# Altium schematic sheet BoardA-Power.SchDoc
size A; SheetNumber: 2; SheetTotal: 2; SPICEModelCachePPHTLYSU: <root> / <DocumentId>PPHTLYSU</DocumentId> / <CacheFrame Number="0"> / <Model Name="umk107bj105_a-t" Kind="CKT"> / <Text>* UMK107BJ105_A-T     SPICE MODEL  ( General Type ) / *-------------------------------------------------------------------------------------------------------- / * Model Generated by TAIYO YUDEN Corporation (http://www.ty-top.com) / * Version 1.0 / * TAIYO YUDEN Control No. 170508_130520 / * Copyright(c) 2012 TAIYO YUDEN CO.,LTD. All Rights Reserved. / *-------------------------------------------------------------------------------------------------------- / * / * Products Name : Multilayer Ceramic Capacitors / * / * Characteristics : / *     Capacitance : 1 uF , Rated Voltage : 50V , TCC : X5R / *     Case Size : 1.6 x 0.8 / 0.063 x 0.031 [mm/inch] , Thickness : 0.8 / 0.031 [mm/inch] / *     (Conditions: Temperature = 25 degC , DC Bias Current/Voltage = 0A / 0V) / * / * Frequency Range : 40Hz - 3GHz / * / * External Node Assignments : / * / *  1  o---| |---o  2 / * / *-------------------------------------------------------------------------------------------------------- / .SubCkt UMK107BJ105_A-T 1 2 / **************************** / C0 1 110 0.79929u / Cm 1 101 0.13681u / C1 101 102 0.26224u / Rc1 101 102 5.8806k / C2 102 103 0.057839u / Rc2 102 103 469.42 / C3 103 110 0.014568u / Rc3 103 110 14.853 / C2m 1 301 0.13283u / C21 301 302 1.2593u / Rc21 301 302 6.3079k / C22 302 303 1.1189u / Rc22 302 303 6.9405k / C23 303 304 1.1421u / Rc23 303 304 6.4848k / C24 304 305 0.36861u / Rc24 304 305 785 / C25 305 306 0.39327u / Rc25 305 306 637.41 / C26 306 307 0.27451u / Rc26 306 307 19.365 / C27 307 308 0.15295u / Rc27 307 308 23.239 / C28 308 309 0.17569u / Rc28 308 309 17.788 / C29 309 110 1420.6p / Rc29 309 110 1.9725 / Rp0 1 110 500Meg / L0 110 120 0.24088n / Lm 120 130 0.1369n / L1 120 121 0.1842n / RL1 121 130 0.29804 / L2 120 122 0.40657n / RL2 122 130 0.57395 / L3 120 123 0.85773n / RL3 123 130 0.82282 / CR 120 124 0.11463u / LR 124 125 0.25983n / RR 125 130 52.447m / CL 130 140 1.4637p / LL 130 140 0.23986n / RL 130 140 33.985 / Rs 140 2 6.8539m / **************************** / .ends UMK107BJ105_A-T</Text> / </Model> / </CacheFrame> / </root>
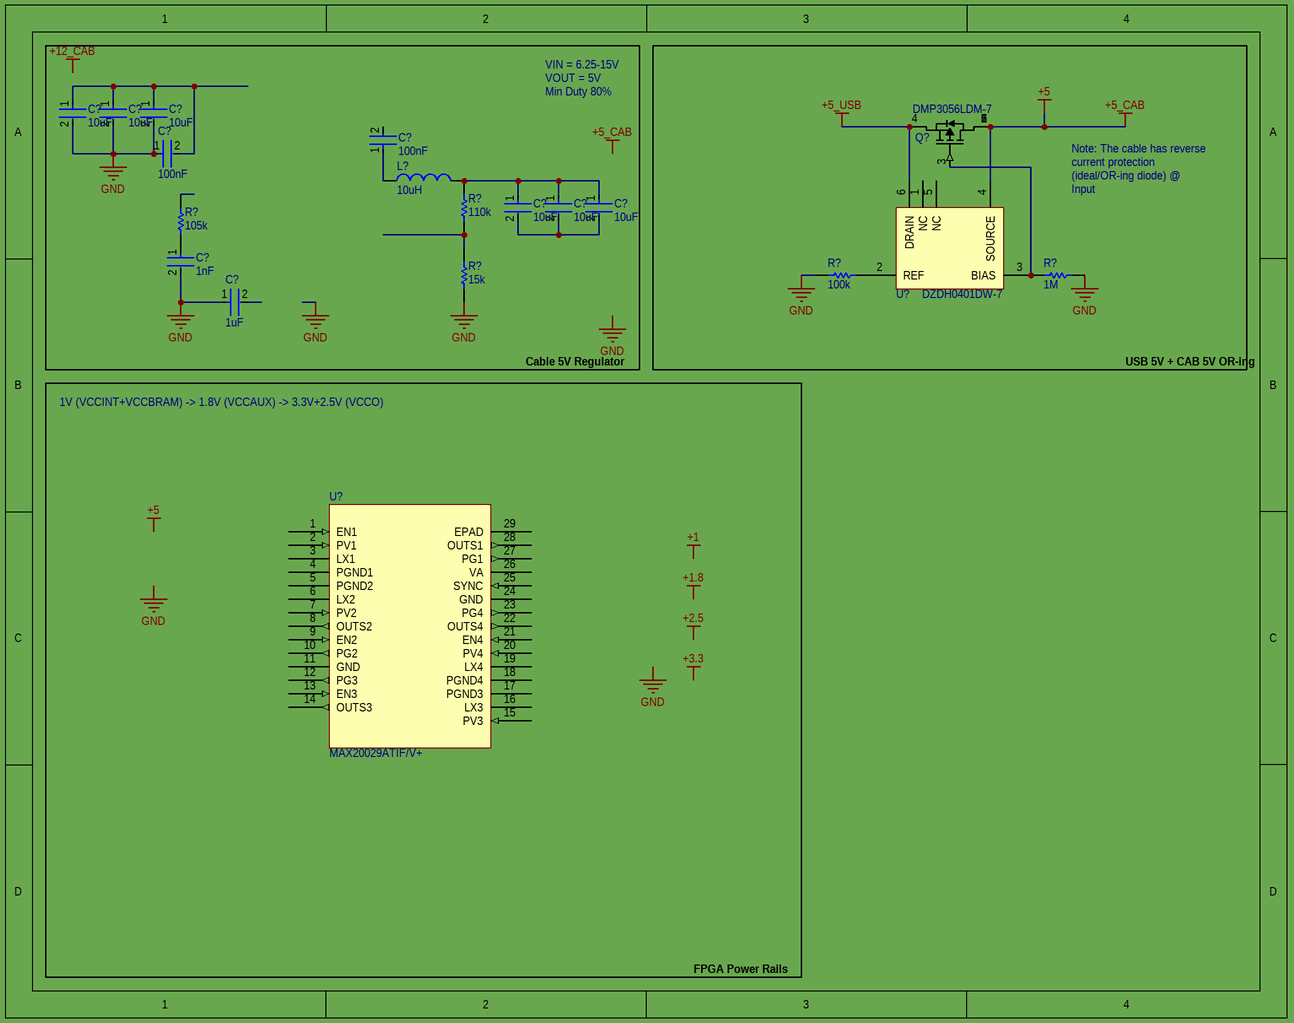
[diagram p0: BoardA-Power.SchDoc]

## Parts
(Parts that share a designator on the sheet are numbered #1, #2 ... from top to bottom, then left to right.)
C?#1  10uF  [FP-GRM188-0_2-MFG]
C?#2  10uF  [FP-GRM188-0_2-MFG]
C?#3  10uF  [FP-GRM188-0_2-MFG]
C?#4  100nF  [FP-CGA3E-0_3-0_1-IPC_C]
C?#5  100nF  [FP-CGA3E-0_3-0_1-IPC_C]
C?#6  10uF  [FP-GRM188-0_2-MFG]
C?#7  10uF  [FP-GRM188-0_2-MFG]
C?#8  10uF  [FP-GRM188-0_2-MFG]
C?#9  1nF  [FP-0603-L_1_6_0_15-W_0_81-IPC_A]
C?#10  1uF  [FP-0603-L_1_6_0_1-W_0_8_0-IPC_A]
L?  10uH  [VISH-IHLP2525C-01_V]
Q?  DMP3056LDM-7  [SOT95P285X130-6N]
R?#1  110k  [RESC1608X55X30ML20T20]
R?#2  105k  [RESC1608X55X30NL15T15]
R?#3  1M  [RESC1608X55X30LL15T15]
R?#4  15k  [RESC1608X55X30NL15T15]
R?#5  100k  [RESC1608X55X30ML20T20]
U?#1  DZDH0401DW-7  [DZDH0401DW-7]
U?#2  MAX20029ATIF/V+  [MAX20029ATIF/V+]

## Blocks framed on the sheet
USB 5V + CAB 5V OR-ing: Q? R?#3 R?#5 U?#1

## Nets
+5: Q?.1 Q?.2 Q?.5 Q?.6 U?#1.4(SOURCE)  [also labelled +5_CAB]
+5_USB: Q?.4 U?#1.6(DRAIN)
GND: C?#1.2 C?#2.2 C?#3.2 C?#4.1 C?#9.2 C?#10.1 R?#3.2 R?#4.1 R?#5.2
NetC?#1_1: C?#1.1 C?#2.1 C?#3.1 C?#4.2
NetC?#5_1: C?#5.1 L?.1
NetC?#6_1: C?#6.1 C?#7.1 C?#8.1 L?.2 R?#1.2
NetC?#6_2: C?#6.2 C?#7.2 C?#8.2
NetC?#9_1: C?#9.1 R?#2.1
NetQ?_3: Q?.3 R?#3.1 U?#1.3(BIAS)
NetR?#1_1: R?#1.1 R?#4.2
NetR?#5_1: R?#5.1 U?#1.2(REF)

Not connected (* = marked no-connect by the designer): C?#5 2; C?#10 2; R?#2 2; U?#1 1(NC) 5(NC); U?#2 1(EN1) 2(PV1) 3(LX1) 4(PGND1) 5(PGND2) 6(LX2) 7(PV2) 8(OUTS2) 9(EN2) 10(PG2) 11(GND) 12(PG3) 13(EN3) 14(OUTS3) 15(PV3) 16(LX3) 17(PGND3) 18(PGND4) 19(LX4) 20(PV4) 21(EN4) 22(OUTS4) 23(PG4) 24(GND) 25(SYNC) 26(VA) 27(PG1) 28(OUTS1) 29(EPAD)

## Notes on the sheet
- VIN = 6.25-15V
- VOUT = 5V
- Min Duty 80%
- Note: The cable has reverse current protection (ideal/OR-ing diode) @ Input
- Cable 5V Regulator
- 1V (VCCINT+VCCBRAM) -> 1.8V (VCCAUX) -> 3.3V+2.5V (VCCO)
- FPGA Power Rails
- Labels drawn without touching a wire or pin: +1, +1.8, +2.5, +3.3, +5, +5_CAB, +12_CAB, GND

## Library data of the parts
C?#1-C?#3 C?#6-C?#8 = CMP-2006-02520-2: Chip Multilayer Ceramic Capacitors for General Purpose, 0603, 10uF, X5R, 15%, 20%, 25V; Tolerance: 20%; Resistor Type: Ceramic; Voltage: 25V; Max Operating Temperature: 85°C; Min Operating Temperature: -55°C; Capacitance: 10uF; Dielectric: X5R; Lead Free: Lead Free; REACH SVHC: No SVHC; Case/Package: 0603; Mount: Surface Mount; Voltage Rating (DC): 25V; Height: 0.8mm; Length: 1.6mm; Thickness: 0.031inch; Width: 0.031inch; Termination: SMD/SMT; Case Code (Imperial): 0603; Case Code (Metric): 1608; Package Quantity: 1; Packaging: Tape and Reel; Depth: 0.8mm; Voltage Rating: 25V; Weight: 0.000222oz; Number of Pins: 2
C?#4 C?#5 = CMP-2000-07546-2: Cap Ceramic 100nF 50V X7R 10% Pad SMD 0603 +125°C Automotive T/R; Weight: 7.1E-05oz; Composition: Ceramic; Max Operating Temperature: 125°C; Termination: SMD/SMT; Dielectric: X7R; Length: 1.6mm; Package Quantity: 1; REACH SVHC: No SVHC; Lead Free: Lead Free; Case Code (Metric): 1608; Min Operating Temperature: -55°C; Packaging: Tape and Reel; Tolerance: 10%; Voltage Rating: 50V; Case Code (Imperial): 0603; Capacitance: 100nF; Case/Package: 0603; Voltage Rating (DC): 50V; Depth: 0.8mm; Radiation Hardening: No; Ratings: AEC-Q200; Mount: Surface Mount; Voltage: 50V; Thickness: 0.035inch; Width: 0.8mm; Height: 0.8mm
C?#9 = CMP-2006-04378-2: General Purpose Ceramic Capacitor, 0603, 1nF, 10%, X7R, 15%, 50V; Case Code (Metric): 1608; Min Operating Temperature: -55°C; Weight: 7.1E-05oz; Series: -; Capacitance: 1nF; RoHS Compliant: Yes; Radiation Hardening: No; Height: 0.9mm; Mount: Surface Mount; REACH SVHC: No SVHC; Lead Free: Lead Free; Depth: 0.81mm; Voltage: 50V; Number of Pins: 2; Voltage Rating: 50V; Max Operating Temperature: 125°C; Termination: SMD/SMT; Construction: Flat; Case Code (Imperial): 0603; Dielectric: X7R; Width: 0.032inch; Tolerance: 10%; Case/Package: 0603; Contact Plating: Tin; Packaging: Tape and Reel; Voltage Rating (DC): 50V; Dielectric Material: Ceramic; Package Quantity: 4000; Thickness: 0.035inch; Length: 1.6mm
C?#10 = CMP-2000-05447-3: None; Tolerance: 10%; Voltage Rating: 50V; Dielectric: X5R; Height: 0.8mm; Depth: 0.8mm; Number of Pins: 2; Length: 1.6mm; Thickness: 0.035inch; Contact Plating: Nickel; Radiation Hardening: No; Package Quantity: 1; Case/Package: 0603; Capacitance: 1uF; Halogen Free: Halogen Free; RoHS Compliant: Yes; Termination: SMD/SMT; Max Operating Temperature: 85°C; Min Operating Temperature: -55°C; Case Code (Metric): 1608; Construction: Flat; Voltage Rating (DC): 50V; Packaging: Tape and Reel; Series: M; Case Code (Imperial): 0603; Width: 0.031inch; Mount: Surface Mount
L? = CMP-2000-06440-1: Low-Profile, High Current IHLP(R) Inductor, 10 uH, 5 MHz, -55 to 125 degC, 2-Pin SMD, RoHS, Tape and Reel; Manufacturer: Vishay; Maximum DC Resistance: 105mOhms; Brand: Vishay/Dale; Type: LowProfileHighCurrentIHLPInductors; Case Width: 6.47mm; Test Frequency: 100kHz; Shielding: Shielded; Self Resonant Frequency: 5MHz; Tolerance: 20%; Case Length: 6.86mm; Case Height: 3mm; Maximum DC Current: 3A; Mounting Technology: SurfaceMount; Product: PowerInductors; Operating Temperature Range: -55Cto+125C; Series: IHLP-2525CZ-01; Package / Case: 2525(6363metric); Termination Style: SMD/SMT; Package Reference: IHLP2525C-01; RoHS: Details; Datasheet Version: 02/2015; Package Description: 2-Pin Surface Mount Device; Manufacturer URL: http://www.vishay.com/; Product Category: FixedInductors; Inductance: 10uH; Packaging: Reel; Datasheet URL: http://download.siliconexpert.com/pdfs/2016/3/15/16/5/35/891/vsh_/manual/812046841784326lp25cz01.pdf
Q? = DMP3056LDM-7: Trans Mosfet P-ch 30V 4.3A 6-PIN SOT-26 T/r / Mosfet P-ch 30V 4.3A SOT-26; Mfr_Name: Diodes Inc; Manufacturer_Part_Number: DMG4407SSS-13; Manufacturer: Diodes; Type: DEV; Rise Time: 6.6ns; Fall Time: 22.3ns; Turn-Off Delay Time: 50.1ns; Turn-On Delay Time: 10.2ns; Gate to Source Voltage (Vgs): 10V; Rds On Max: 45mR; Input Capacitance: 948pF; Number of Elements: 1; Max Power Dissipation: 1.5W; Drain to Source Breakdown Voltage: -30V; Element Configuration: Single; Polarity: P-CHANNEL; Copyright: Copyright (C) 2022 Ultra Librarian. All rights reserved.; RefDes: RefDes; Supplier 1: Arrow Electronics; Manufacturer Part Number: DMP3056LDM-7; RoHS: Yes; Category: MOSFETs; Stock 1: 366; Pricing 1: 1=0.31620, 10=0.31310, 25=0.30990, 100=0.23530, 250=0.23300, 500=0.20610, 1000=0.19360, 3000=0.17330 (USD); Mount: Surface Mount; Case/Package: SOT-26-6; Number of Pins: 6; Weight: 0.000529oz; Min Operating Temperature: -55°C; Max Operating Temperature: 150°C; Continuous Drain Current (ID): 4.3A; Package Quantity: 3000; Packaging: Cut Tape; Drain to Source Voltage (Vdss): 30V; Power Dissipation: 1.5W; Drain to Source Resistance: 45mR; Number of Channels: 1; Series: DMP3056; Length: 3mm; Width: 1.6mm; Height: 1.1mm; Radiation Hardening: No; REACH SVHC: No SVHC; Lead Free: Lead Free; RoHS Compliant: Yes; ComponentLink1URL: https://datasheet.ciiva.com/935/ds31449-935056.pdf?src-supplier=Digi-Key; ComponentLink1Description: https://datasheet.ciiva.com/935/ds31449-935056.pdf?src-supplier=Digi-Key; ComponentLink2URL: https://datasheet.ciiva.com/935/ds31449-935055.pdf?src-supplier=Digi-Key; ComponentLink2Description: https://datasheet.ciiva.com/935/ds31449-935055.pdf?src-supplier=Digi-Key; ComponentLink3URL: https://datasheet.ciiva.com/935/ds31449-935057.pdf?src-supplier=Digi-Key; ComponentLink3Description: https://datasheet.ciiva.com/935/ds31449-935057.pdf?src-supplier=Digi-Key; ComponentLink4URL: https://datasheet.ciiva.com/11176/ds31449-11176470.pdf?src-supplier=Avnet; ComponentLink4Description: https://datasheet.ciiva.com/11176/ds31449-11176470.pdf?src-supplier=Avnet; ComponentLink5URL: https://datasheet.ciiva.com/8115/ds31449-8115483.pdf?src-supplier=Avnet; ComponentLink5Description: https://datasheet.ciiva.com/8115/ds31449-8115483.pdf?src-supplier=Avnet; Supplier Part Number 1: DMP3056LDM-7
R?#1 = CMP-2000-00886-1: Part Number: ERA3AEB114V; Manufacturer: Panasonic
R?#2 = CMP-2000-00190-1: Part Number: ERJ-3EKF1053V; Manufacturer: Panasonic
R?#3 = CMP-1012-00849-2: Manufacturer: Panasonic; Part Number: ERJ-3EKF1004V
R?#4 = CMP-2000-00258-1: Part Number: ERJ-3EKF1502V; Manufacturer: Panasonic
R?#5 = CMP-2000-00875-1: Part Number: ERA3AEB104V; Manufacturer: Panasonic
U?#1 = DZDH0401DW-7: Ideal Diode Controller 40V 300mA 300mW 6-Pin SOT-363 T/R; Mfr_Name: Diodes Inc; Manufacturer: Diodes; Copyright: Copyright (C) 2022 Ultra Librarian. All rights reserved.; Manufacturer_Part_Number: DZDH0401DW-7; RefDes: RefDes; Type: DEV; Supplier 1: Mouser; Manufacturer Part Number: DZDH0401DW-7; RoHS: Yes; Stock 1: 1625; Pricing 1: 1=0.43000, 10=0.32400, 50=0.32400, 100=0.17000, 500=0.13800, 1000=0.10600, 3000=0.09000, 10000=0.09000 (USD); Supplier Part Number 1: 621-DZDH0401DW-7
U?#2 = MAX20029ATIF/V+: DC to DC Converter Quad Step-Down 3V to 5.5V Automotive 28-Pin TQFN Tube; Mfr_Name: Maxim Integrated Products; Manufacturer: Maxim; Copyright: Copyright (C) 2022 Ultra Librarian. All rights reserved.; Manufacturer_Part_Number: MAX20029ATIF/V+; RefDes: RefDes; Type: DEV; Supplier 1: Mouser; Manufacturer Part Number: MAX20029ATIF/V+; RoHS: Yes; Stock 1: 121; Pricing 1: 1=3.71000, 10=3.34000, 25=3.15000, 50=3.15000, 100=3.15000, 120=2.72000, 300=2.64000, 540=2.41000, 1000=2.41000, 1020=2.29000, 2520=2.25000, 10000=2.25000 (USD); Supplier Part Number 1: 700-MAX20029ATIF/V+